# Altium schematic sheet 0805W8F4700T5E1_0805W8F4700T5E.schdoc
size 127 x 99 mm
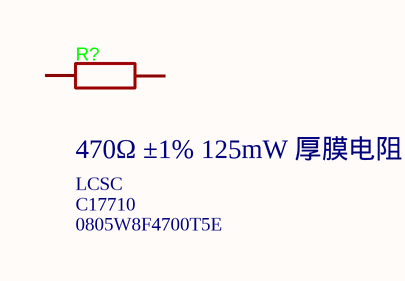
[diagram p0: 0805W8F4700T5E1_0805W8F4700T5E.schdoc]

## Parts
R?  Supplier: LCSC  Supplier Part: C17710  LCSC Part Name: 470Ω ±1% 125mW 厚膜电阻  [R0805]  (hidden comment: 470Ω)

## Nets

Not connected (* = marked no-connect by the designer): R? 1 2

## Library data of the parts
R? = 0805W8F4700T5E: Manufacturer: UNI-ROYAL(厚声); Add into BOM: yes; Tolerance: ±1%; Power(Watts): 125mW; Voltage-Supply(Max): 150V; Temperature Coefficient: ±100ppm/℃; Symbol: 0805W8F4700T5E; Device: 0805W8F4700T5E; Manufacturer Part: 0805W8F4700T5E; Supplier Footprint: 0805; JLCPCB Part Class: Basic Part; Datasheet: https://item.szlcsc.com/datasheet/0805W8F4700T5E/18398.html; Convert to PCB: yes; Type: Thick Film Resistor; Value: 470Ω; Operating Temperature: -55℃~+155℃